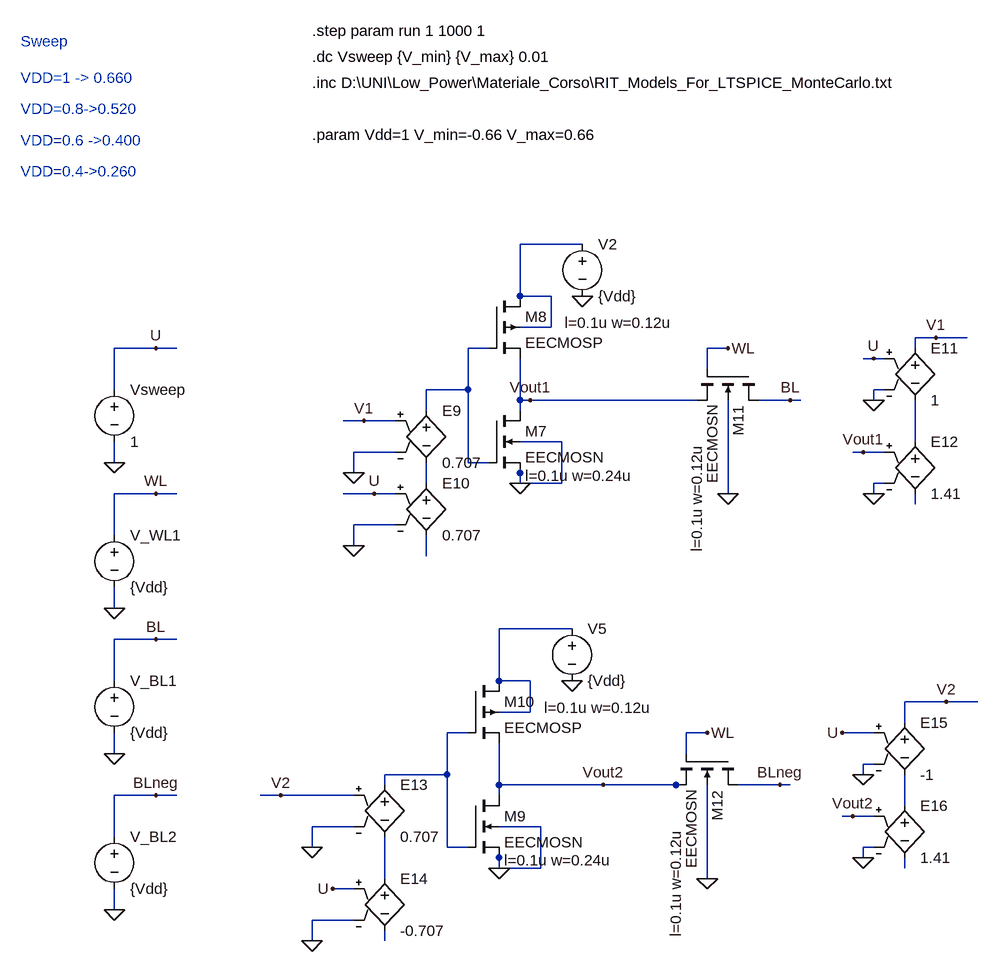
[diagram p0: schematic Draft3.asc]
Draft3.asc, the LTspice schematic file:
Version 4
SHEET 1 1568 2516
WIRE 464 1424 368 1424
WIRE 368 1504 368 1424
WIRE 416 1504 368 1504
WIRE 416 1552 416 1504
WIRE 416 1552 368 1552
WIRE 1008 1568 976 1568
WIRE 1056 1568 1008 1568
WIRE -192 1584 -256 1584
WIRE -160 1584 -192 1584
WIRE 320 1584 288 1584
WIRE 688 1584 656 1584
WIRE 976 1584 976 1568
WIRE 912 1600 896 1600
WIRE 928 1600 912 1600
WIRE 656 1616 656 1584
WIRE -256 1648 -256 1584
WIRE 288 1648 288 1584
WIRE 288 1648 224 1648
WIRE 928 1648 912 1648
WIRE 368 1664 368 1600
WIRE 384 1664 368 1664
WIRE 640 1664 384 1664
WIRE 784 1664 736 1664
WIRE 800 1664 784 1664
WIRE 912 1664 912 1648
WIRE 224 1680 224 1648
WIRE 368 1680 368 1664
WIRE 128 1696 96 1696
WIRE 176 1696 128 1696
WIRE 432 1728 368 1728
WIRE 976 1728 976 1664
WIRE 176 1744 112 1744
WIRE 896 1744 880 1744
WIRE 928 1744 896 1744
WIRE -256 1760 -256 1728
WIRE 288 1760 288 1648
WIRE 320 1760 288 1760
WIRE 112 1776 112 1744
WIRE 368 1776 368 1760
WIRE 224 1792 224 1760
WIRE 368 1792 368 1776
WIRE 432 1792 432 1728
WIRE 432 1792 368 1792
WIRE 928 1792 912 1792
WIRE -192 1808 -256 1808
WIRE -160 1808 -192 1808
WIRE 144 1808 96 1808
WIRE 176 1808 144 1808
WIRE 688 1808 688 1664
WIRE 912 1808 912 1792
WIRE 976 1824 976 1808
WIRE 176 1856 112 1856
WIRE -256 1872 -256 1808
WIRE 112 1888 112 1856
WIRE 224 1904 224 1872
WIRE -256 1984 -256 1952
WIRE 448 2016 336 2016
WIRE -192 2032 -256 2032
WIRE -160 2032 -192 2032
WIRE -256 2096 -256 2032
WIRE 336 2096 336 2016
WIRE 384 2096 336 2096
WIRE 1024 2128 960 2128
WIRE 1072 2128 1024 2128
WIRE 384 2144 384 2096
WIRE 384 2144 336 2144
WIRE 960 2160 960 2128
WIRE 288 2176 256 2176
WIRE 656 2176 624 2176
WIRE 912 2176 864 2176
WIRE -256 2208 -256 2176
WIRE 624 2208 624 2176
WIRE 912 2224 896 2224
WIRE 256 2240 256 2176
WIRE 256 2240 160 2240
WIRE 896 2240 896 2224
WIRE 160 2256 160 2240
WIRE 336 2256 336 2192
WIRE 496 2256 336 2256
WIRE 608 2256 496 2256
WIRE 624 2256 608 2256
WIRE 768 2256 704 2256
WIRE 784 2256 768 2256
WIRE -192 2272 -256 2272
WIRE -160 2272 -192 2272
WIRE 0 2272 -32 2272
WIRE 112 2272 0 2272
WIRE 336 2272 336 2256
WIRE 960 2288 960 2240
WIRE 880 2304 864 2304
WIRE 912 2304 880 2304
WIRE 112 2320 48 2320
WIRE 400 2320 336 2320
WIRE -256 2336 -256 2272
WIRE 48 2352 48 2320
WIRE 256 2352 256 2240
WIRE 288 2352 256 2352
WIRE 912 2352 896 2352
WIRE 336 2368 336 2352
WIRE 896 2368 896 2352
WIRE 336 2384 336 2368
WIRE 400 2384 400 2320
WIRE 400 2384 336 2384
WIRE 960 2384 960 2368
WIRE 160 2400 160 2336
WIRE 656 2400 656 2256
WIRE 112 2416 80 2416
WIRE -256 2448 -256 2416
WIRE 112 2464 48 2464
WIRE 48 2496 48 2464
WIRE 160 2496 160 2480
FLAG 368 1792 0
FLAG 112 1888 0
FLAG 112 1776 0
FLAG -256 1760 0
FLAG -192 1584 U
FLAG 144 1808 U
FLAG 128 1696 V1
FLAG 464 1504 0
FLAG 912 1808 0
FLAG 912 1664 0
FLAG 896 1744 Vout1
FLAG 912 1600 U
FLAG 384 1664 Vout1
FLAG 1008 1568 V1
FLAG 336 2384 0
FLAG 48 2496 0
FLAG 48 2352 0
FLAG 80 2416 U
FLAG 0 2272 V2
FLAG 448 2096 0
FLAG 896 2368 0
FLAG 896 2240 0
FLAG 880 2304 Vout2
FLAG 864 2176 U
FLAG 496 2256 Vout2
FLAG 1024 2128 V2
FLAG 688 1808 0
FLAG 688 1584 WL
FLAG -256 1984 0
FLAG -192 1808 WL
FLAG 656 2400 0
FLAG 656 2176 WL
FLAG 784 1664 BL
FLAG 768 2256 BLneg
FLAG -256 2208 0
FLAG -192 2032 BL
FLAG -256 2448 0
FLAG -192 2272 BLneg
SYMBOL nmos4 320 1680 R0
WINDOW 123 56 100 Left 2
SYMATTR Value2 l=0.1u w=0.24u
SYMATTR InstName M7
SYMATTR Value EECMOSN
SYMBOL pmos4 320 1504 R0
WINDOW 123 117 41 Left 2
SYMATTR Value2 l=0.1u w=0.12u
SYMATTR InstName M8
SYMATTR Value EECMOSP
SYMBOL e 224 1664 R0
SYMATTR InstName E9
SYMATTR Value 0.707
SYMBOL e 224 1776 R0
SYMATTR InstName E10
SYMATTR Value 0.707
SYMBOL voltage -256 1632 R0
WINDOW 123 0 0 Left 0
WINDOW 39 0 0 Left 0
SYMATTR InstName Vsweep
SYMATTR Value 1
SYMBOL voltage 464 1408 R0
WINDOW 123 0 0 Left 0
WINDOW 39 0 0 Left 0
SYMATTR InstName V2
SYMATTR Value {Vdd}
SYMBOL e 976 1568 R0
SYMATTR InstName E11
SYMATTR Value 1
SYMBOL e 976 1712 R0
SYMATTR InstName E12
SYMATTR Value 1.41
SYMBOL nmos4 288 2272 R0
WINDOW 123 56 100 Left 2
SYMATTR Value2 l=0.1u w=0.24u
SYMATTR InstName M9
SYMATTR Value EECMOSN
SYMBOL pmos4 288 2096 R0
WINDOW 123 117 41 Left 2
SYMATTR Value2 l=0.1u w=0.12u
SYMATTR InstName M10
SYMATTR Value EECMOSP
SYMBOL e 160 2240 R0
SYMATTR InstName E13
SYMATTR Value 0.707
SYMBOL e 160 2384 R0
SYMATTR InstName E14
SYMATTR Value -0.707
SYMBOL voltage 448 2000 R0
WINDOW 123 0 0 Left 0
WINDOW 39 0 0 Left 0
SYMATTR InstName V5
SYMATTR Value {Vdd}
SYMBOL e 960 2144 R0
SYMATTR InstName E15
SYMATTR Value -1
SYMBOL e 960 2272 R0
SYMATTR InstName E16
SYMATTR Value 1.41
SYMBOL nmos4 736 1616 R90
WINDOW 123 116 96 Left 2
SYMATTR Value2 l=0.1u w=0.12u
SYMATTR InstName M11
SYMATTR Value EECMOSN
SYMBOL voltage -256 1856 R0
WINDOW 123 0 0 Left 0
WINDOW 39 0 0 Left 0
SYMATTR InstName V_WL1
SYMATTR Value {Vdd}
SYMBOL nmos4 704 2208 R90
WINDOW 123 116 96 Left 2
SYMATTR Value2 l=0.1u w=0.12u
SYMATTR InstName M12
SYMATTR Value EECMOSN
SYMBOL voltage -256 2080 R0
WINDOW 123 0 0 Left 0
WINDOW 39 0 0 Left 0
SYMATTR InstName V_BL1
SYMATTR Value {Vdd}
SYMBOL voltage -256 2320 R0
WINDOW 123 0 0 Left 0
WINDOW 39 0 0 Left 0
SYMATTR InstName V_BL2
SYMATTR Value {Vdd}
TEXT 48 1136 Left 2 !.dc Vsweep {V_min} {V_max} 0.01
TEXT 48 1096 Left 2 !.step param run 1 1000 1
TEXT -400 1168 Left 2 ;VDD=1 -> 0.660
TEXT -400 1264 Left 2 ;VDD=0.6 ->0.400
TEXT -400 1216 Left 2 ;VDD=0.8->0.520
TEXT -400 1312 Left 2 ;VDD=0.4->0.260
TEXT -400 1112 Left 2 ;Sweep
TEXT 48 1256 Left 2 !.param Vdd=1 V_min=-0.66 V_max=0.66
TEXT 48 1176 Left 2 !.inc D:\\UNI\\Low_Power\\Materiale_Corso\\RIT_Models_For_LTSPICE_MonteCarlo.txt

The netlist it stands for:
* Draft3.asc
M7 Vout1 N002 0 0 EECMOSN l=0.1u w=0.24u
M8 N001 N002 Vout1 N001 EECMOSP l=0.1u w=0.12u
E9 N002 N004 V1 0 0.707
E10 N004 N006 U 0 0.707
Vsweep U 0 1
V2 N001 0 {Vdd}
E11 V1 N003 U 0 1
E12 N003 N005 Vout1 0 1.41
M9 Vout2 N008 0 0 EECMOSN l=0.1u w=0.24u
M10 N007 N008 Vout2 N007 EECMOSP l=0.1u w=0.12u
E13 N008 N011 V2 0 0.707
E14 N011 N012 U 0 -0.707
V5 N007 0 {Vdd}
E15 V2 N009 U 0 -1
E16 N009 N010 Vout2 0 1.41
M11 BL WL Vout1 0 EECMOSN l=0.1u w=0.12u
V_WL1 WL 0 {Vdd}
M12 BLneg WL Vout2 0 EECMOSN l=0.1u w=0.12u
V_BL1 BL 0 {Vdd}
V_BL2 BLneg 0 {Vdd}
.model NMOS NMOS
.model PMOS PMOS
.lib standard.mos
.dc Vsweep {V_min} {V_max} 0.01
.step param run 1 1000 1
* VDD=1 -> 0.660
* VDD=0.6 ->0.400
* VDD=0.8->0.520
* VDD=0.4->0.260
* Sweep
.param Vdd=1 V_min=-0.66 V_max=0.66
.inc D:\UNI\Low_Power\Materiale_Corso\RIT_Models_For_LTSPICE_MonteCarlo.txt
.backanno
.end